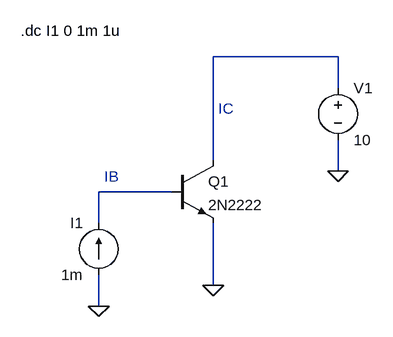
[diagram p0: schematic 4.1.asc]
4.1.asc, the LTspice schematic file:
Version 4
SHEET 1 880 680
WIRE 592 64 400 64
WIRE 592 112 592 64
WIRE 400 224 400 64
WIRE 592 240 592 192
WIRE 336 272 224 272
WIRE 224 320 224 272
WIRE 400 416 400 320
WIRE 224 448 224 400
FLAG 592 240 0
FLAG 400 416 0
FLAG 224 448 0
SYMBOL npn 336 224 R0
SYMATTR InstName Q1
SYMATTR Value 2N2222
SYMBOL voltage 592 96 R0
SYMATTR InstName V1
SYMATTR Value 10
SYMBOL current 224 400 R180
WINDOW 0 24 80 Left 2
WINDOW 3 24 0 Left 2
SYMATTR InstName I1
SYMATTR Value 1m
TEXT 232 248 Left 2 ;IB
TEXT 408 144 Left 2 ;IC
TEXT 104 24 Left 2 !.dc I1 0 1m 1u

The netlist it stands for:
* 4.1.asc
Q1 N001 N002 0 0 2N2222
V1 N001 0 10
I1 0 N002 1m
.model NPN NPN
.model PNP PNP
.lib standard.bjt
* IB
* IC
.dc I1 0 1m 1u
.backanno
.end